# Altium schematic sheet WatchX_Pro.SchDoc
size A4
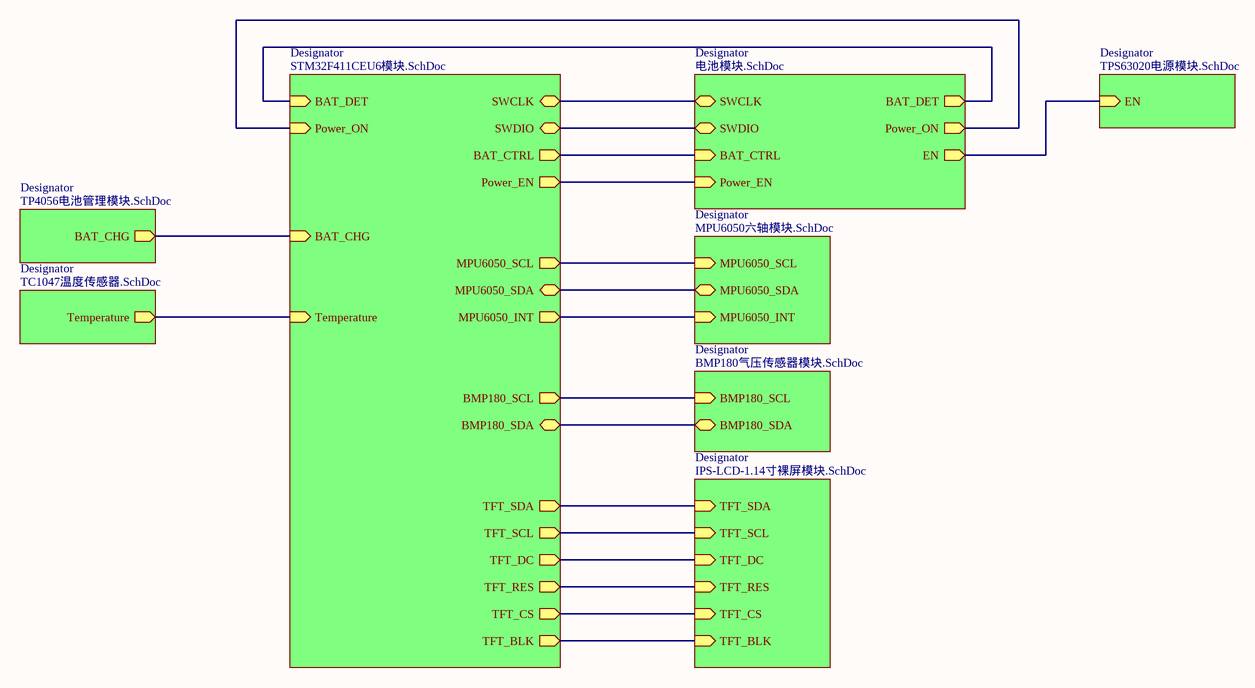
[diagram p0: WatchX_Pro.SchDoc]

## Sub-sheets
Designator = BMP180气压传感器模块.SchDoc: BMP180_SCL (in), BMP180_SDA (bidir)
Designator = IPS-LCD-1.14寸裸屏模块.SchDoc: TFT_SDA (in), TFT_SCL (in), TFT_DC (in), TFT_RES (in), TFT_CS (in), TFT_BLK (in)
Designator = MPU6050六轴模块.SchDoc: MPU6050_SCL (in), MPU6050_SDA (bidir), MPU6050_INT (in)
Designator = STM32F411CEU6模块.SchDoc: BMP180_SCL (out), BMP180_SDA (bidir), Temperature (in), Power_ON (in), Power_EN (out), MPU6050_SCL (out), MPU6050_SDA (bidir), MPU6050_INT (out), TFT_SDA (out), TFT_SCL (out), TFT_DC (out), TFT_RES (out), TFT_CS (out), TFT_BLK (out), BAT_DET (in), BAT_CHG (in), BAT_CTRL (out), SWCLK (bidir), SWDIO (bidir)
Designator = TP4056电池管理模块.SchDoc: BAT_CHG (out)
Designator = TPS63020电源模块.SchDoc: EN (in)
Designator = TC1047温度传感器.SchDoc: Temperature (out)
Designator = 电池模块.SchDoc: SWCLK (bidir), SWDIO (bidir), BAT_DET (out), BAT_CTRL (in), Power_ON (out), Power_EN (in), EN (out)

## Nets
(unnamed): sheet Designator/BMP180_SCL, sheet Designator/BMP180_SCL
(unnamed): sheet Designator/BMP180_SDA, sheet Designator/BMP180_SDA
(unnamed): sheet Designator/TFT_SDA, sheet Designator/TFT_SDA
(unnamed): sheet Designator/TFT_SCL, sheet Designator/TFT_SCL
(unnamed): sheet Designator/TFT_DC, sheet Designator/TFT_DC
(unnamed): sheet Designator/TFT_RES, sheet Designator/TFT_RES
(unnamed): sheet Designator/TFT_CS, sheet Designator/TFT_CS
(unnamed): sheet Designator/TFT_BLK, sheet Designator/TFT_BLK
(unnamed): sheet Designator/MPU6050_SCL, sheet Designator/MPU6050_SCL
(unnamed): sheet Designator/MPU6050_SDA, sheet Designator/MPU6050_SDA
(unnamed): sheet Designator/MPU6050_INT, sheet Designator/MPU6050_INT
(unnamed): sheet Designator/Temperature, sheet Designator/Temperature
(unnamed): sheet Designator/Power_ON, sheet Designator/Power_ON
(unnamed): sheet Designator/Power_EN, sheet Designator/Power_EN
(unnamed): sheet Designator/BAT_DET, sheet Designator/BAT_DET
(unnamed): sheet Designator/BAT_CHG, sheet Designator/BAT_CHG
(unnamed): sheet Designator/BAT_CTRL, sheet Designator/BAT_CTRL
(unnamed): sheet Designator/SWCLK, sheet Designator/SWCLK
(unnamed): sheet Designator/SWDIO, sheet Designator/SWDIO
(unnamed): sheet Designator/EN, sheet Designator/EN